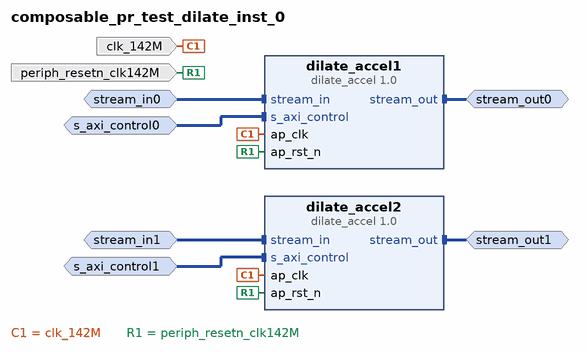
[diagram p0: block diagram of the top level]
# Vivado block design composable_pr_test_dilate_inst_0, xc7z020clg400-1, Vivado 2020.2.2
create_bd_design composable_pr_test_dilate_inst_0

create_bd_intf_port -mode Slave -vlnv xilinx.com:interface:aximm_rtl:1.0 s_axi_control0
create_bd_intf_port -mode Slave -vlnv xilinx.com:interface:aximm_rtl:1.0 s_axi_control1
create_bd_intf_port -mode Slave -vlnv xilinx.com:interface:axis_rtl:1.0 stream_in0
create_bd_intf_port -mode Slave -vlnv xilinx.com:interface:axis_rtl:1.0 stream_in1
create_bd_intf_port -mode Master -vlnv xilinx.com:interface:axis_rtl:1.0 stream_out0
create_bd_intf_port -mode Master -vlnv xilinx.com:interface:axis_rtl:1.0 stream_out1
create_bd_port -dir I -type clk clk_142M
create_bd_port -dir I -type rst periph_resetn_clk142M

create_bd_cell -type ip -vlnv xilinx.com:hls:dilate_accel:1.0 dilate_accel2
create_bd_cell -type ip -vlnv xilinx.com:hls:dilate_accel:1.0 dilate_accel1

# ---- connections ----

connect_bd_intf_net -intf_net stream_in1_1 [get_bd_intf_ports stream_in1] [get_bd_intf_pins dilate_accel2/stream_in]
connect_bd_intf_net -intf_net s_axi_control1_1 [get_bd_intf_ports s_axi_control1] [get_bd_intf_pins dilate_accel2/s_axi_control]
connect_bd_intf_net [get_bd_intf_ports stream_out0] [get_bd_intf_pins dilate_accel1/stream_out]
connect_bd_intf_net -intf_net stream_in0_1 [get_bd_intf_ports stream_in0] [get_bd_intf_pins dilate_accel1/stream_in]
connect_bd_intf_net -intf_net s_axi_control0_1 [get_bd_intf_ports s_axi_control0] [get_bd_intf_pins dilate_accel1/s_axi_control]
connect_bd_intf_net -intf_net erode_accel_stream_out [get_bd_intf_ports stream_out1] [get_bd_intf_pins dilate_accel2/stream_out]
connect_bd_net [get_bd_ports clk_142M] [get_bd_pins dilate_accel2/ap_clk] [get_bd_pins dilate_accel1/ap_clk]
connect_bd_net [get_bd_ports periph_resetn_clk142M] [get_bd_pins dilate_accel2/ap_rst_n] [get_bd_pins dilate_accel1/ap_rst_n]

# ---- address map ----
assign_bd_address -offset 0x00000000 -range 64K -target_address_space [get_bd_addr_spaces s_axi_control0] [get_bd_addr_segs dilate_accel1/s_axi_control/Reg]
assign_bd_address -offset 0x00000000 -range 32K -target_address_space [get_bd_addr_spaces s_axi_control1] [get_bd_addr_segs dilate_accel2/s_axi_control/Reg]

validate_bd_design
save_bd_design
